# EAGLE schematic Leddriverboard (EAGLE 6.4)
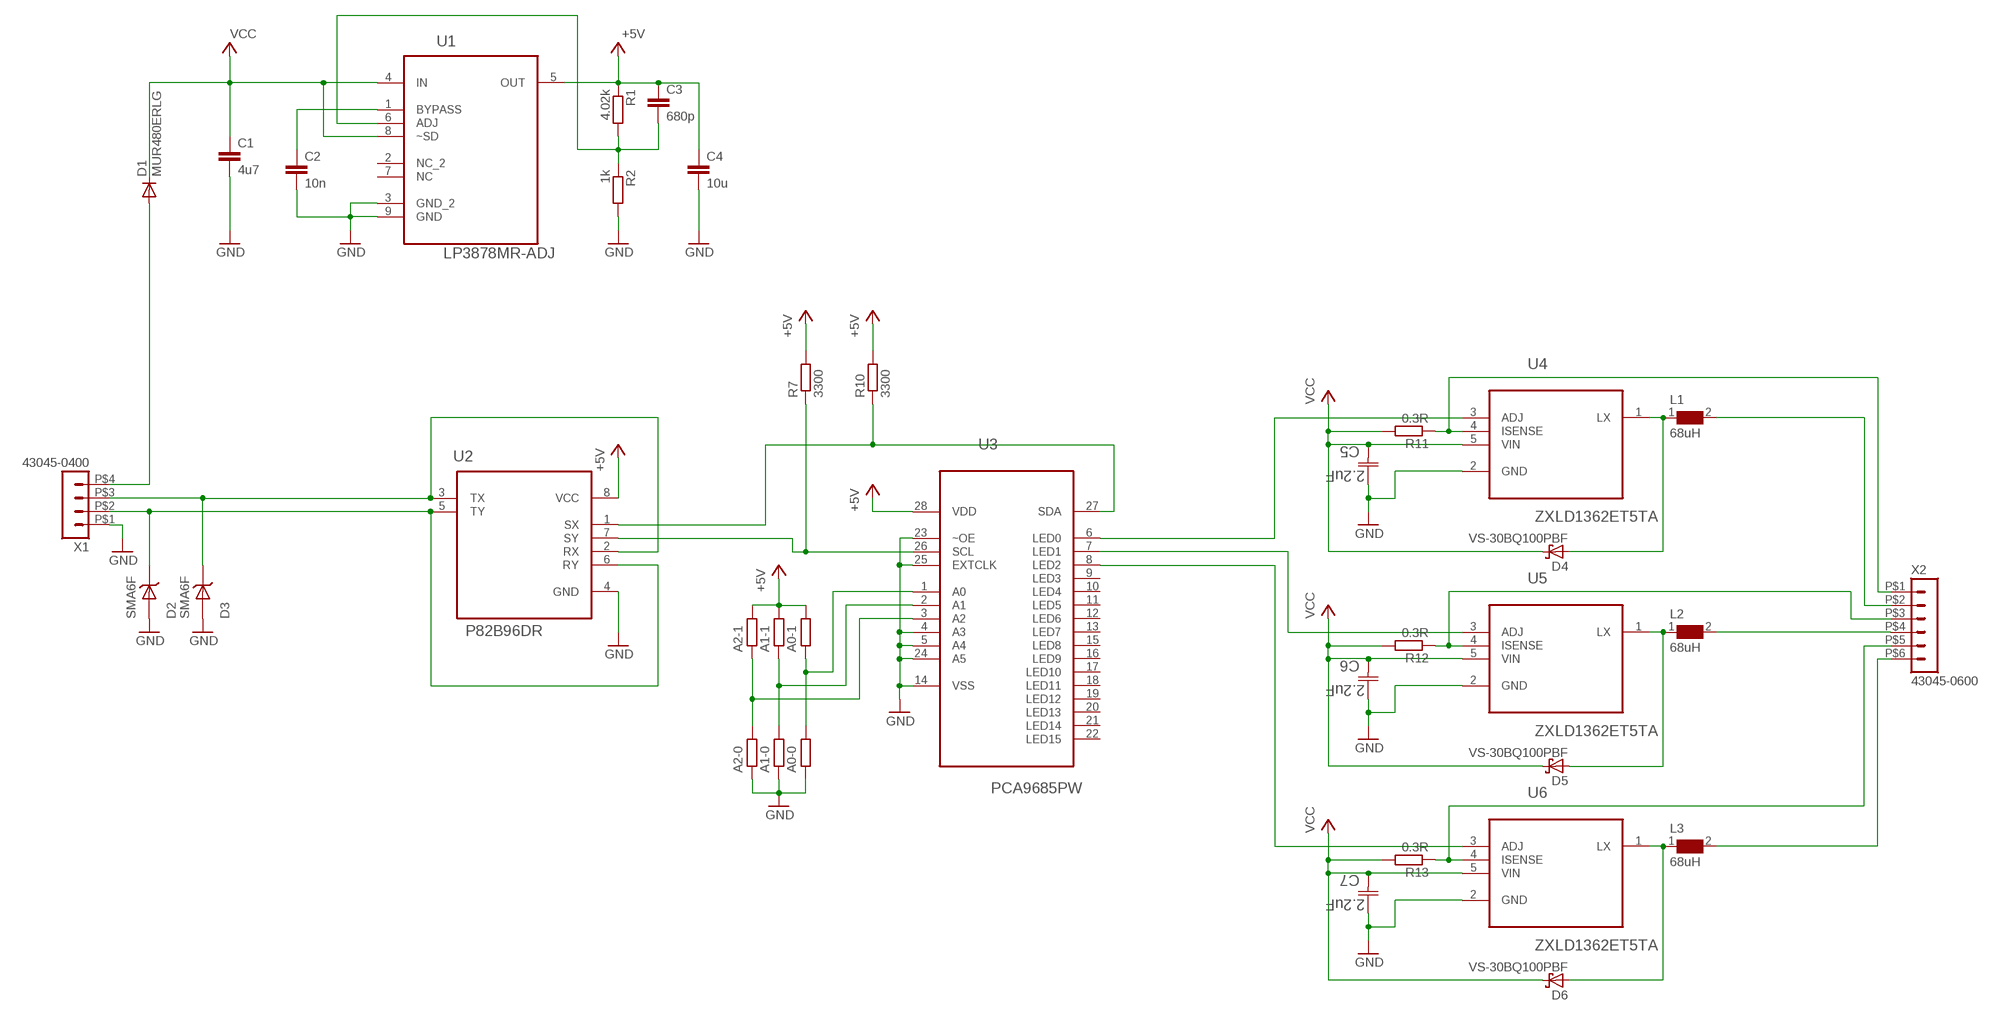
[diagram p0: schematic, sheet 1]

## Parts
C1  4u7  C-EUC1206  [C1206]
C2  10n  C-EUC1608  [C1608]
C3  680p  C-EUC1608  [C1608]
C4  10u  C-EUC2012  [C2012]
C5  2.2uF  08053C225KAT2A  [CAPC2013X152N]
C6  2.2uF  08053C225KAT2A  [CAPC2013X152N]
C7  2.2uF  08053C225KAT2A  [CAPC2013X152N]
D1  MUR480ERLG  MUR150RL  [DO41-10]
D2  SMA6F  [DO-221AC]
D3  SMA6F  [DO-221AC]
D4  VS-30BQ100PBF  [DO-214AB]
D5  VS-30BQ100PBF  [DO-214AB]
D6  VS-30BQ100PBF  [DO-214AB]
L1  68uH  WE-PD4-74456168_L  [L]
L2  68uH  WE-PD4-74456168_L  [L]
L3  68uH  WE-PD4-74456168_L  [L]
R1  4.02k  R-EU_R0603  [R0603]
R2  1k  R-EU_R0603  [R0603]
R3  A2-1  R-EU_R0402  [R0402]
R4  A2-0  R-EU_R0402  [R0402]
R5  A1-1  R-EU_R0402  [R0402]
R6  A1-0  R-EU_R0402  [R0402]
R7  3300  R-EU_0204/7  [0204/7]
R8  A0-1  R-EU_R0402  [R0402]
R9  A0-0  R-EU_R0402  [R0402]
R10  3300  R-EU_0204/7  [0204/7]
R11  0.3R  R-EU_R0603  [R0603]
R12  0.3R  R-EU_R0603  [R0603]
R13  0.3R  R-EU_R0603  [R0603]
U1  LP3878MR-ADJ  [SOIC127P600X168-8N]
U2  P82B96DR  [SOIC127P600X175-8N]
U3  PCA9685PW  [SOP65P640X110-28N]
U4  ZXLD1362ET5TA  [SOT95P270X145-5N]
U5  ZXLD1362ET5TA  [SOT95P270X145-5N]
U6  ZXLD1362ET5TA  [SOT95P270X145-5N]
X1  43045-0400  HEADER_POS4_43045-0401  [43045-0400]
X2  43045-0600  HEADER_POS6_43045-0600  [43045-0600]

## Nets
+5V [Normal Bcc]: C3.1 C4.1 R1.1 R3.2 R5.2 R7.2 R8.2 R10.2 U1.5(OUT) U2.8(VCC) U3.28(VDD)
GND: C1.2 C2.2 C4.2 C5.1(C1) C6.1(C1) C7.1(C1) D2.AN D3.AN R2.2 R4.1 R6.1 R9.1 U1.3(GND_2) U1.9(GND) U2.4(GND) U3.4(A3) U3.5(A4) U3.14(VSS) U3.23(~OE) U3.24(A5) U3.25(EXTCLK) U4.2(GND) U5.2(GND) U6.2(GND) X1.P$1
N$1 [LED Current]: R11.1 U4.4(ISENSE) X2.P$1
N$2: U3.7(LED1) U5.3(ADJ)
N$4 [LED Current]: R12.1 U5.4(ISENSE) X2.P$3
N$5 [LED Current]: L2.2 X2.P$4
N$6 [LED Current]: L1.2 X2.P$2
N$7: D3.KAT U2.2(RX) U2.3(TX) X1.P$3
N$8: U3.6(LED0) U4.3(ADJ)
N$9 [LED Current]: D5.A L2.1 U5.1(LX)
N$10 [LED Current]: D4.A L1.1 U4.1(LX)
N$15: U3.8(LED2) U6.3(ADJ)
N$16 [LED Current]: R13.1 U6.4(ISENSE) X2.P$5
N$18 [LED Current]: L3.2 X2.P$6
N$19 [LED Current]: D6.A L3.1 U6.1(LX)
N$22: D2.KAT U2.5(TY) U2.6(RY) X1.P$2
N$24: C3.2 R1.2 R2.1 U1.6(ADJ)
N$25 [Big Vcc]: D1.A X1.P$4
N$26: C2.1 U1.1(BYPASS)
N$41: R8.1 R9.2 U3.1(A0)
N$42: R5.1 R6.2 U3.2(A1)
N$43: R3.1 R4.2 U3.3(A2)
SCL: R7.1 U2.7(SY) U3.26(SCL)
SDA: R10.1 U2.1(SX) U3.27(SDA)
VCC [Big Vcc]: C1.1 C5.2(C2) C6.2(C2) C7.2(C2) D1.C D4.K(C) D5.K(C) D6.K(C) R11.2 R12.2 R13.2 U1.4(IN) U1.8(~SD) U4.5(VIN) U5.5(VIN) U6.5(VIN)
Unconnected: U1.2(NC_2) U1.7(NC) U3.9(LED3) U3.10(LED4) U3.11(LED5) U3.12(LED6) U3.13(LED7) U3.15(LED8) U3.16(LED9) U3.17(LED10) U3.18(LED11) U3.19(LED12) U3.20(LED13) U3.21(LED14) U3.22(LED15)

## Library data of the parts
C1-C4 = rcl:C-EU: CAPACITOR, European symbol
C5-C7 = AVX_By_element14_Batch_1:08053C225KAT2A: Capacitor 0805; MPN: 08053C225KAT2A; OC_FARNELL: 1657931; OC_NEWARK: 10R5975; SUPPLIER: AVX; TOLERANCE: ±10%; VOLTAGERATING: 25V
D1 = diode:MUR150RL: DIODE
D2 D3 = MyComponents:SMA6F
D4-D6 = MyComponents:VS-30BQ100PBF
L1-L3 = WE-PD4:WE-PD4: SMD-Power Inductors WE-PD4 - Current loading up to 35 A - Compact size - Low-loss ferrite core - High storage capacity - Industry standardized size - Application frequency range up to 10 MHz -- Is recommended for the application with switching regulators from National Semiconductor, Linear Technology, Texas Instruments and Fairchild Semiconductor -- Noise suppression -- Perfectly suitable for switching regulators with extremely high efficiency; MPN: 74456168; OC_FARNELL: 1636136; OC_NEWARK: 08P2689; PACKAGE: Type_L; SUPPLIER: Wuerth Elektronik
R1-R6 R8 R9 R11-R13 = resistor:R-EU_: RESISTOR, European symbol
R7 R10 = rcl:R-EU_: RESISTOR, European symbol
U1 = Texas:LP3878MR-ADJ: Voltage Regulator; MPN: LP3878MR-ADJ; OC_FARNELL: 1286784; OC_NEWARK: 65K6513; PACKAGE: SOIC-8; SUPPLIER: NationalSemiconductor
U2 = Texas:P82B96DR: DUAL BIDIRECTIONAL BUS BUFFER; MPN: P82B96DR; OC_FARNELL: 1576671; OC_NEWARK: 88K6385; PACKAGE: SOIC-8; SUPPLIER: Texas Instruments
U3 = NXP_By_element14_Batch_1:PCA9685PW: 16-channel, 12-bit PWM Fm+ I2C-bus LED controller; MPN: PCA9685PW; OC_FARNELL: 1854074; OC_NEWARK: 19T6398; PACKAGE: TSSOP-28; SUPPLIER: NXP
U4-U6 = ZEtex:ZXLD1362ET5TA: 60V 1A LED DRIVER WITH AEC-Q100; MPN: ZXLD1362ET5TA; OC_FARNELL: 1843876; OC_NEWARK: 12T2272; PACKAGE: SOT-5; SUPPLIER: DIODES INC.
X1 = con-molex-micro-fit-3_0:HEADER_POS4_?: Molex - Micro-Fit 3.0 Series connector, 3.00mm (0.118") pitch header, 4 positions.
X2 = con-molex-micro-fit-3_0:HEADER_POS6_?: Molex - Micro-Fit 3.0 Series connector, 3.00mm (0.118") pitch header, 6 positions.

## Net classes
0 default: width 0.2 mm, clearance 0.2 mm
1 Normal Bcc: width 0.152 mm, clearance 0.2 mm
2 Big Vcc: width 0.762 mm, clearance 0.2 mm
3 LED Current: width 0.152 mm, clearance 0.2 mm